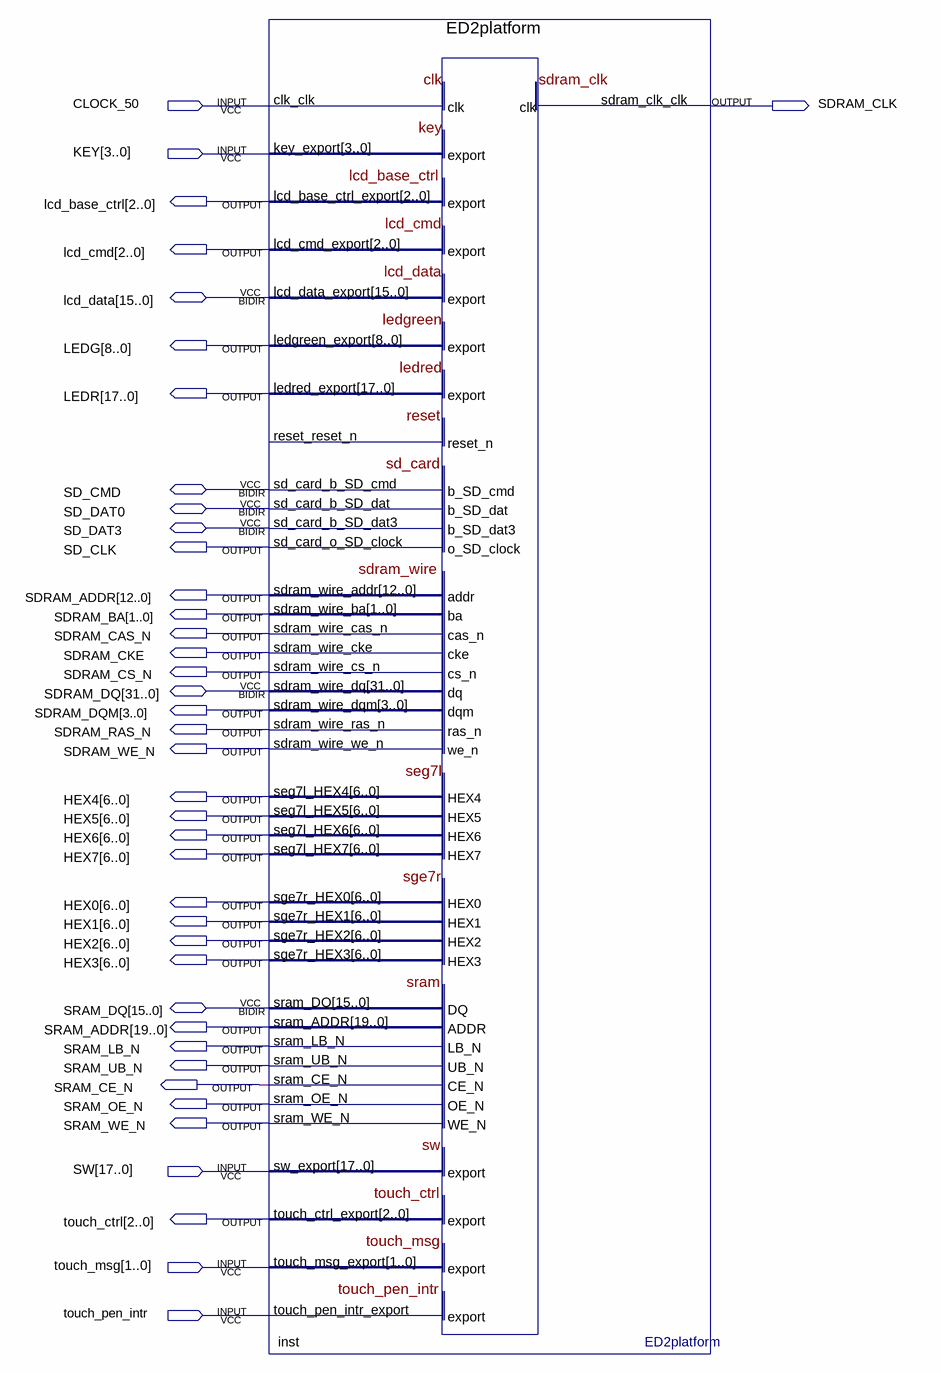
[diagram p0: schematic sheet]
// Quartus schematic DE2_115.bdf as structural Verilog: 1 symbols, 40 pins
module DE2_115 (
  input  CLOCK_50,
  input  [3:0] KEY,
  input  [17:0] SW,
  input  [1:0] touch_msg,
  input  touch_pen_intr,
  inout  [15:0] lcd_data,
  inout  SD_CMD,
  inout  SD_DAT0,
  inout  SD_DAT3,
  inout  [31:0] SDRAM_DQ,
  inout  [15:0] SRAM_DQ,
  output SDRAM_CLK,
  output [2:0] lcd_base_ctrl,
  output [2:0] lcd_cmd,
  output [8:0] LEDG,
  output [17:0] LEDR,
  output SD_CLK,
  output [12:0] SDRAM_ADDR,
  output [1:0] SDRAM_BA,
  output SDRAM_CAS_N,
  output SDRAM_CKE,
  output SDRAM_CS_N,
  output [3:0] SDRAM_DQM,
  output SDRAM_RAS_N,
  output SDRAM_WE_N,
  output [6:0] HEX4,
  output [6:0] HEX5,
  output [6:0] HEX6,
  output [6:0] HEX7,
  output [6:0] HEX0,
  output [6:0] HEX1,
  output [6:0] HEX2,
  output [6:0] HEX3,
  output [19:0] SRAM_ADDR,
  output SRAM_LB_N,
  output SRAM_UB_N,
  output SRAM_CE_N,
  output SRAM_OE_N,
  output SRAM_WE_N,
  output [2:0] touch_ctrl
);

  ED2platform inst (
    .clk_clk(CLOCK_50), .key_export(KEY), .sw_export(SW), .touch_msg_export(touch_msg),
    .touch_pen_intr_export(touch_pen_intr), .lcd_base_ctrl_export(lcd_base_ctrl), .lcd_cmd_export(lcd_cmd),
    .ledgreen_export(LEDG), .ledred_export(LEDR), .sd_card_o_SD_clock(SD_CLK), .sdram_clk_clk(SDRAM_CLK),
    .sdram_wire_addr(SDRAM_ADDR), .sdram_wire_ba(SDRAM_BA), .sdram_wire_cas_n(SDRAM_CAS_N),
    .sdram_wire_cke(SDRAM_CKE), .sdram_wire_cs_n(SDRAM_CS_N), .sdram_wire_dqm(SDRAM_DQM),
    .sdram_wire_ras_n(SDRAM_RAS_N), .sdram_wire_we_n(SDRAM_WE_N), .seg7l_HEX4(HEX4), .seg7l_HEX5(HEX5),
    .seg7l_HEX6(HEX6), .seg7l_HEX7(HEX7), .sge7r_HEX0(HEX0), .sge7r_HEX1(HEX1), .sge7r_HEX2(HEX2),
    .sge7r_HEX3(HEX3), .sram_ADDR(SRAM_ADDR), .sram_LB_N(SRAM_LB_N), .sram_UB_N(SRAM_UB_N),
    .sram_CE_N(SRAM_CE_N), .sram_OE_N(SRAM_OE_N), .sram_WE_N(SRAM_WE_N), .touch_ctrl_export(touch_ctrl),
    .lcd_data_export(lcd_data), .sd_card_b_SD_cmd(SD_CMD), .sd_card_b_SD_dat(SD_DAT0),
    .sd_card_b_SD_dat3(SD_DAT3), .sdram_wire_dq(SDRAM_DQ), .sram_DQ(SRAM_DQ));  // open: reset_reset_n
endmodule
